# EAGLE design Device_board_191219 (EAGLE 9.5.1)
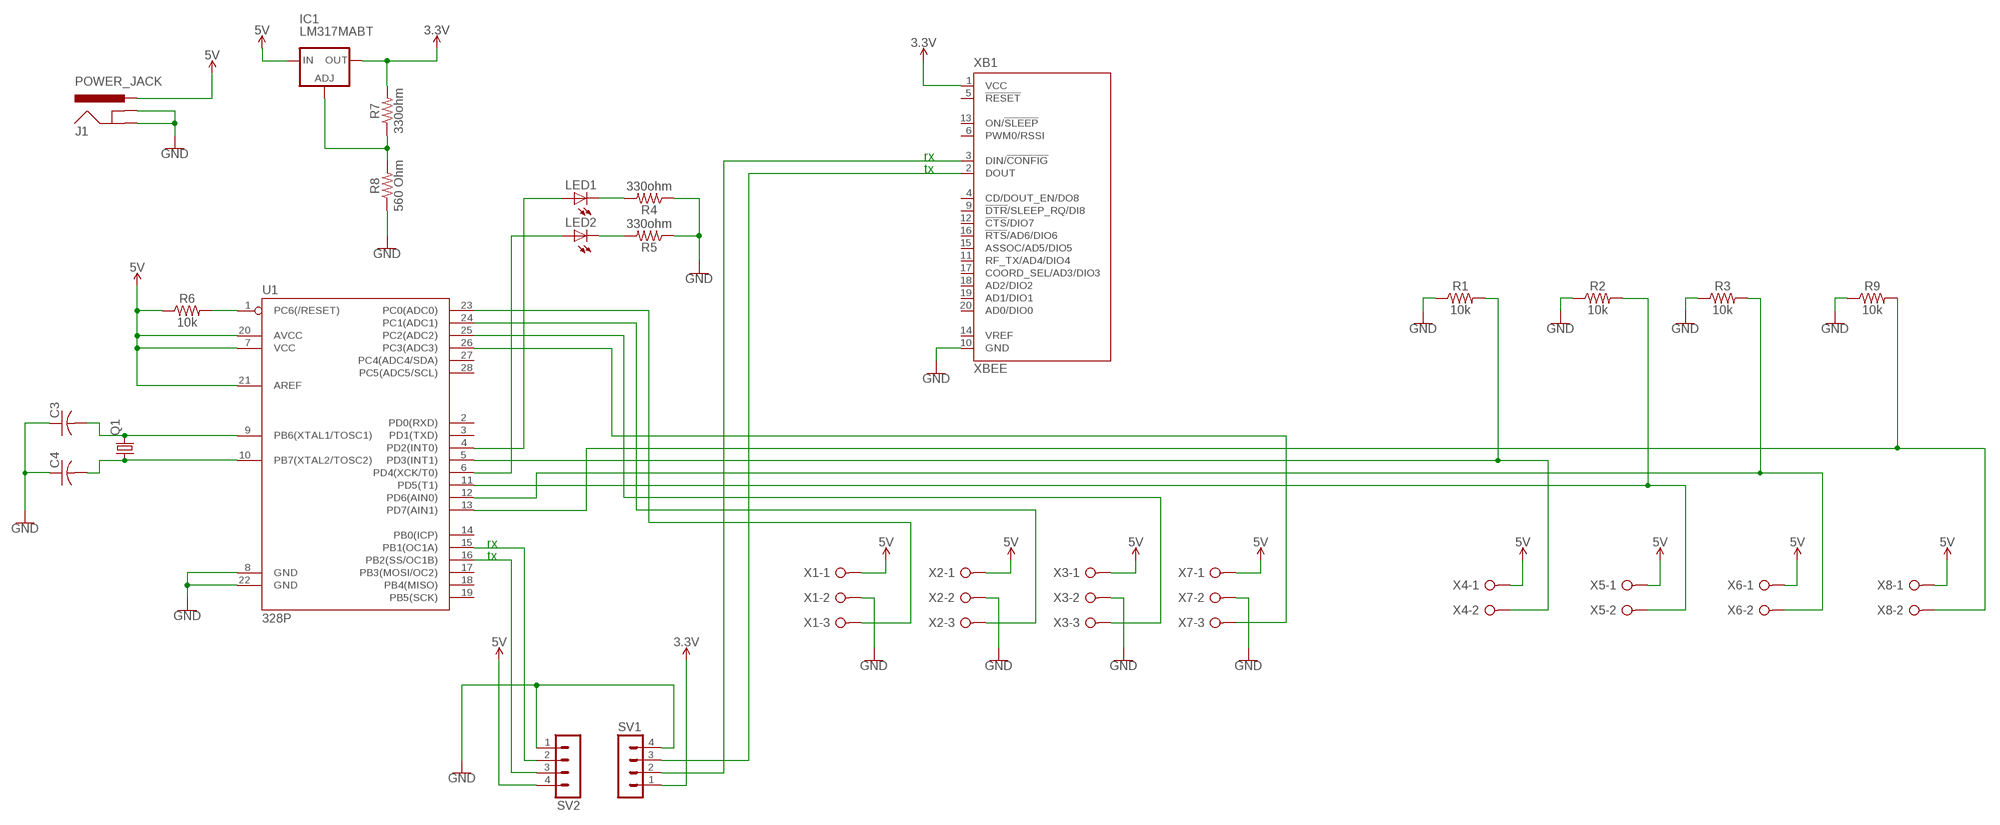
[diagram p0: schematic, sheet 1]

## Parts
C3  C-US050-025X075  [C050-025X075]
C4  C-US050-025X075  [C050-025X075]
IC1  LM317MABT  [TO220L1]
J1  POWER_JACK  [POWER_JACK_PTH]
LED1  LED3MM  [LED3MM]
LED2  LED3MM  [LED3MM]
Q1  CRYSTALHC49S  [HC49/S]
R1  10k  10KOHM-HORIZ-1/4W-5%  [AXIAL-0.3]
R2  10k  10KOHM-HORIZ-1/4W-5%  [AXIAL-0.3]
R3  10k  10KOHM-HORIZ-1/4W-5%  [AXIAL-0.3]
R4  330ohm  10KOHM-HORIZ-1/4W-5%  [AXIAL-0.3]
R5  330ohm  10KOHM-HORIZ-1/4W-5%  [AXIAL-0.3]
R6  10k  10KOHM-HORIZ-1/4W-5%  [AXIAL-0.3]
R7  330ohm  10KOHM-HORIZ-1/4W-5%  [AXIAL-0.3]
R8  560 Ohm  10KOHM-HORIZ-1/4W-5%  [AXIAL-0.3]
R9  10k  10KOHM-HORIZ-1/4W-5%  [AXIAL-0.3]
SV1  MA04-1  [MA04-1]
SV2  MA04-1  [MA04-1]
U1  328P  ATMEGA328P_PDIP  [DIP28]
X1  W237-3E  [W237-3E]
X2  W237-3E  [W237-3E]
X3  W237-3E  [W237-3E]
X4  W237-02P  [W237-132]
X5  W237-02P  [W237-132]
X6  W237-02P  [W237-132]
X7  W237-3E  [W237-3E]
X8  W237-02P  [W237-132]
XB1  XBEE  [XBEE]

## Nets
3.3V: IC1.2(OUT) R7.P$2 SV1.1 XB1.1(VCC)
5V: IC1.3(IN) J1.PWR R6.P$1 SV2.4 U1.7(VCC) U1.20(AVCC) U1.21(AREF) X1.1 X2.1 X3.1 X4.1 X5.1 X6.1 X7.1 X8.1
GND: C3.1 C4.1 J1.GND J1.GNDBREAK R1.P$1 R2.P$1 R3.P$1 R4.P$1 R5.P$1 R8.P$1 R9.P$1 SV1.4 SV2.1 U1.8(GND) U1.22(GND) X1.2 X2.2 X3.2 X7.2 XB1.10(GND)
N$1: SV1.2 XB1.3(DIN/!CONFIG)
N$2: SV1.3 XB1.2(DOUT)
N$3: U1.23(PC0(ADC0)) X1.3
N$4: U1.24(PC1(ADC1)) X2.3
N$5: U1.25(PC2(ADC2)) X3.3
N$6: R3.P$2 U1.12(PD6(AIN0)) X6.2
N$7: R1.P$2 U1.5(PD3(INT1)) X4.2
N$8: LED1.A U1.4(PD2(INT0))
N$9: LED2.A U1.6(PD4(XCK/T0))
N$10: U1.26(PC3(ADC3)) X7.3
N$11: LED2.K(C) R5.P$2
N$12: LED1.K(C) R4.P$2
N$13: C3.2 Q1.2 U1.9(PB6(XTAL1/TOSC1))
N$14: C4.2 Q1.1 U1.10(PB7(XTAL2/TOSC2))
N$15: R6.P$2 U1.1(PC6(/RESET))
N$16: IC1.1(ADJ) R7.P$1 R8.P$2
N$17: R2.P$2 U1.11(PD5(T1)) X5.2
N$18: R9.P$2 U1.13(PD7(AIN1)) X8.2
N$19: SV2.2 U1.15(PB1(OC1A))
N$20: SV2.3 U1.16(PB2(SS/OC1B))
Unconnected: U1.2(PD0(RXD)) U1.3(PD1(TXD)) U1.14(PB0(ICP)) U1.17(PB3(MOSI/OC2)) U1.18(PB4(MISO)) U1.19(PB5(SCK)) U1.27(PC4(ADC4/SDA)) U1.28(PC5(ADC5/SCL)) XB1.4(CD/DOUT_EN/DO8) XB1.5(!RESET) XB1.6(PWM0/RSSI) XB1.9(!DTR!/SLEEP_RQ/DI8) XB1.11(RF_TX/AD4/DIO4) XB1.12(!CTS!/DIO7) XB1.13(ON/!SLEEP) XB1.14(VREF) XB1.15(ASSOC/AD5/DIO5) XB1.16(!RTS!/AD6/DIO6) XB1.17(COORD_SEL/AD3/DIO3) XB1.18(AD2/DIO2) XB1.19(AD1/DIO1) XB1.20(AD0/DIO0)

## Notes on the sheet
- rx
- tx
- rx
- tx

## Library data of the parts
C3 C4 = adafruit:C-US: CAPACITOR, American symbol
IC1 = v-reg:LM317?*: 500 mA Adjustable Output Positive Voltage Regulator Source: http://www.onsemi.co.jp .. LM317M-D.PDF
J1 = SparkFun-Connectors:POWER_JACK: Power Jack Connector This is the standard 5.5mm barrel jack for power. The PTH is the most common, proven, reliable, footprint. The Slot footprint only works if the mill layer is transmitted to the PCB fab house so be warned. Here are the connectors we sell at SparkFun: DC Barrel Power Jack/Connector <https://www.sparkfun.com/products/119> (PRT-00119) DC Barrel Power Jack/Connector (SMD) <https://www.sparkfun.com/products/12748> (PRT-12748) DC Barrel Jack Adapter - Breadboard Compatible <https://www.sparkfun.com/products/10811> (PRT-10811) It is used on this SparkFun product (and many, many others): SparkFun RedBoard - Programmed with Arduino <https://www.sparkfun.com/products/12757> (DEV-12757) Also, if you need a mating power supply or connector, please check these out: Wall Adapter Power Supply - 9VDC 650mA <https://www.sparkfun.com/products/298> (TOL-00298) DC Barrel Jack Adapter - Male <https://www.sparkfun.com/products/10287> (PRT-10287); PROD_ID: CONN-08197
LED1 LED2 = adafruit:LED: LED OSRAM: - CHIPLED LG R971, LG N971, LY N971, LG Q971, LY Q971, LO R971, LY R971 LH N974, LH R974 LS Q976, LO Q976, LY Q976 LO Q996 - Hyper CHIPLED LW Q18S LB Q993, LB Q99A, LB R99A - SideLED LS A670, LO A670, LY A670, LG A670, LP A670 LB A673, LV A673, LT A673, LW A673 LH A674 LY A675 LS A676, LA A676, LO A676, LY A676, LW A676 LS A679, LY A679, LG A679 - Hyper Micro SIDELED® LS Y876, LA Y876, LO Y876, LY Y876 LT Y87S - SmartLED LW L88C, LW L88S LB L89C, LB L89S, LG L890 LS L89K, LO L89K, LY L89K LS L896, LA L896, LO L896, LY L896 - TOPLED LS T670, LO T670, LY T670, LG T670, LP T670 LSG T670, LSP T670, LSY T670, LOP T670, LYG T670 LG T671, LOG T671, LSG T671 LB T673, LV T673, LT T673, LW T673 LH T674 LS T676, LA T676, LO T676, LY T676, LB T676, LH T676, LSB T676, LW T676 LB T67C, LV T67C, LT T67C, LS T67K, LO T67K, LY T67K, LW E67C LS E67B, LA E67B, LO E67B, LY E67B, LB E67C, LV E67C, LT E67C LW T67C LS T679, LY T679, LG T679 LS T770, LO T770, LY T770, LG T770, LP T770 LB T773, LV T773, LT T773, LW T773 LH T774 LS E675, LA E675, LY E675, LS T675 LS T776, LA T776, LO T776, LY T776, LB T776 LHGB T686 LT T68C, LB T68C - Hyper Mini TOPLED® LB M676 - Mini TOPLED Santana® LG M470 LS M47K, LO M47K, LY M47K Source: http://www.osram.convergy.de/
Q1 = adafruit:CRYSTAL: CRYSTAL; OC_FARNELL: 1667008; OC_NEWARK: unknown
R1-R3 R6 R9 = SparkFun-Resistors:10KOHM: 10kΩ resistor A resistor is a passive two-terminal electrical component that implements electrical resistance as a circuit element. Resistors act to reduce current flow, and, at the same time, act to lower voltage levels within circuits. - Wikipedia; PROD_ID: RES-09435
R4 R5 R7 R8 = SparkFun-Resistors:10KOHM: 10kΩ resistor A resistor is a passive two-terminal electrical component that implements electrical resistance as a circuit element. Resistors act to reduce current flow, and, at the same time, act to lower voltage levels within circuits. - Wikipedia; PROD_ID: RES-09435; VALUE: 10k
SV1 SV2 = con-lstb:MA04-1: PIN HEADER; OC_FARNELL: unknown; OC_NEWARK: unknown
U1 = SparkFun-IC-Microcontroller:ATMEGA328P_PDIP: Atmel 328P Through hole ATMEGA328P uC used in the Arduino 32kb flash, 1k EEPROM, 2k SRAM Datasheet <http://www.sparkfun.com/datasheets/Components/SMD/ATMega328.pdf> SparkFun Products Storefront component: AVR 28 Pin 20MHz 32K 6A/D - ATMega328P <https://www.sparkfun.com/products/9061> (COM-09061) SparkFun Simon Says - Through-Hole Soldering Kit <https://www.sparkfun.com/products/10547> (KIT-10547) SparkFun Learn to Solder - Simon Says <https://www.sparkfun.com/products/13708> (KIT-13708) SparkFun BigTime Watch Kit <https://www.sparkfun.com/products/11734> (KIT-11734) SparkFun ClockIt <https://www.sparkfun.com/products/10930> (KIT-10930) SparkFun Serial Enabled LCD Kit <https://www.sparkfun.com/products/10097> (LCD-10097) SparkFun Simon Tilts - Through Hole Soldering Kit <https://www.sparkfun.com/products/12634> (KIT-12634) SparkFun Frequency Counter Kit <https://www.sparkfun.com/products/10140> (KIT-10140) FabFM Radio Kit <https://www.sparkfun.com/products/11043> (KIT-11043) SparkFun Binary Blaster Kit <https://www.sparkfun.com/products/12037> (KIT-12037) SparkFun Metro-Gnome <https://www.sparkfun.com/products/9236> (KIT-09236) ATmega328 with Arduino Optiboot (Uno) <https://www.sparkfun.com/products/10524> (DEV-10524); PROD_ID: IC-09136
X1-X3 X7 = con-wago-508:W237-3E: WAGO SREW CLAMP; OC_FARNELL: unknown; OC_NEWARK: unknown
X4-X6 X8 = con-wago-508:W237-02P: WAGO SREW CLAMP; OC_FARNELL: unknown; OC_NEWARK: unknown
XB1 = maxstream:XBEE: XBee (TM) /XBee-PRO(TM) OEM RF Modules Source: MaxStream, Inc. xbee_productmanual.pdf; MPN: XBP24-Z7UIT-004; OC_FARNELL: 1751799; OC_NEWARK: 34R5507

## Board
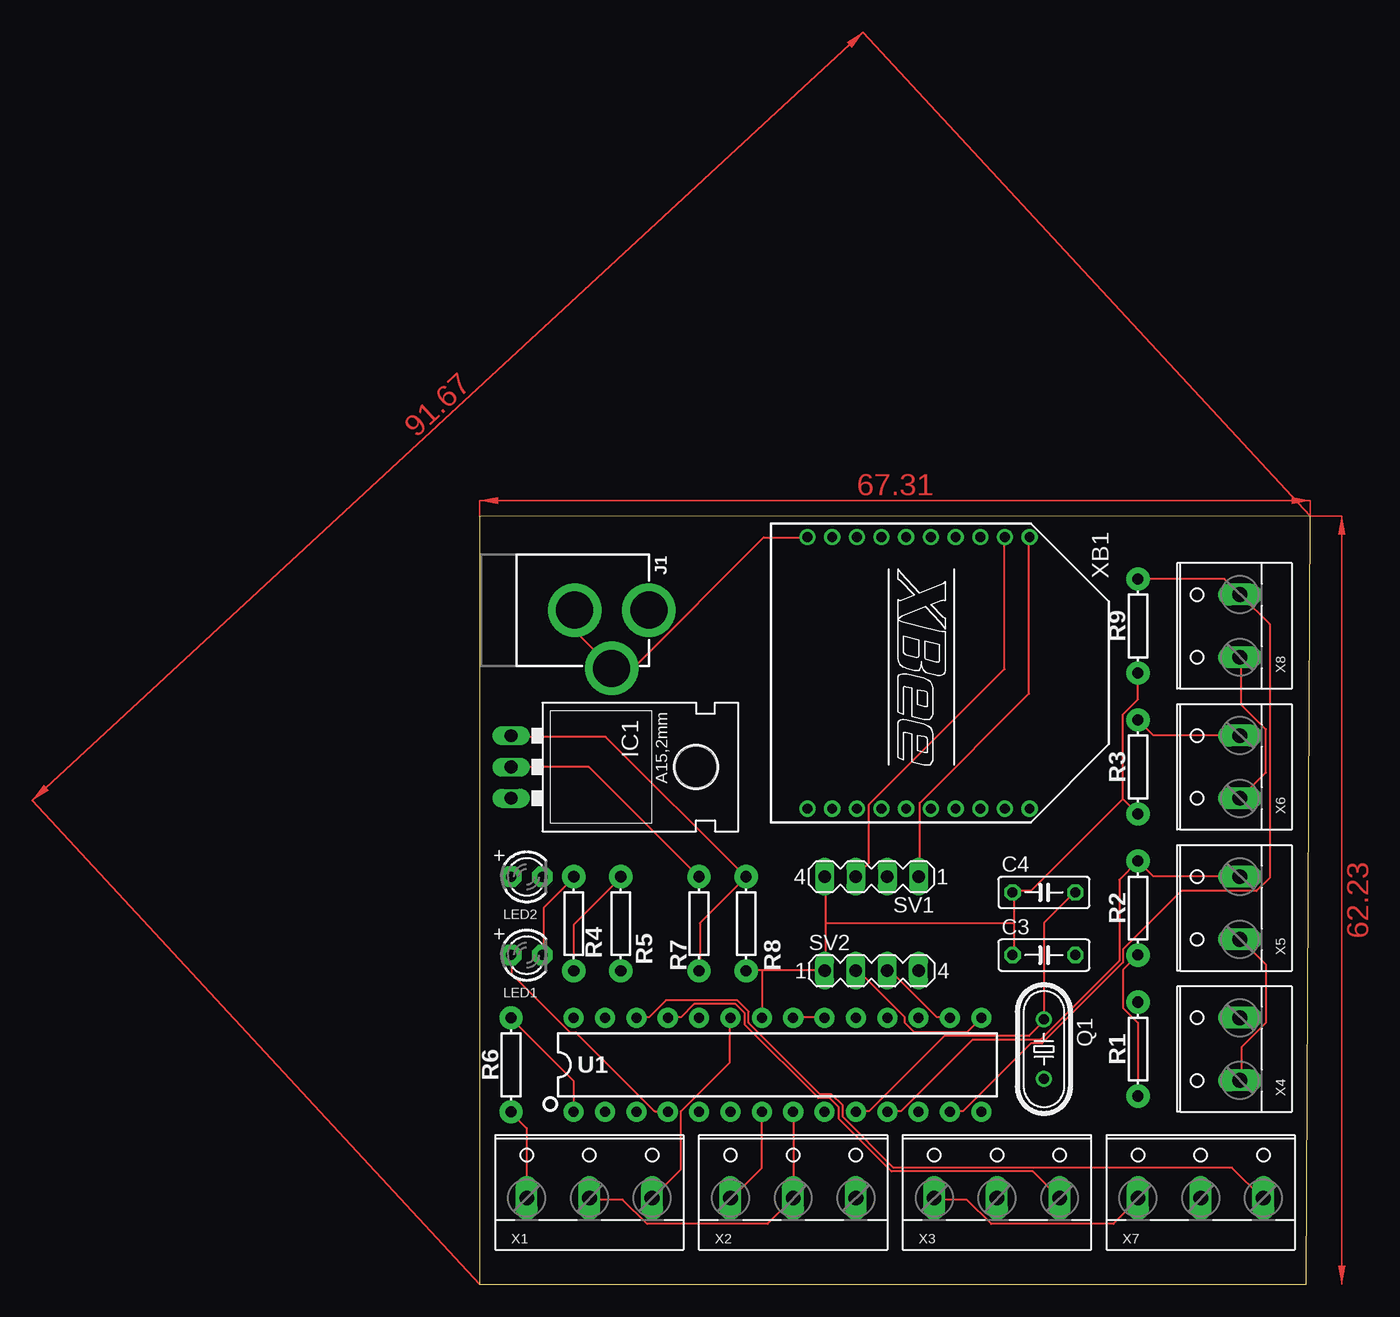
[diagram p1: board, top side]
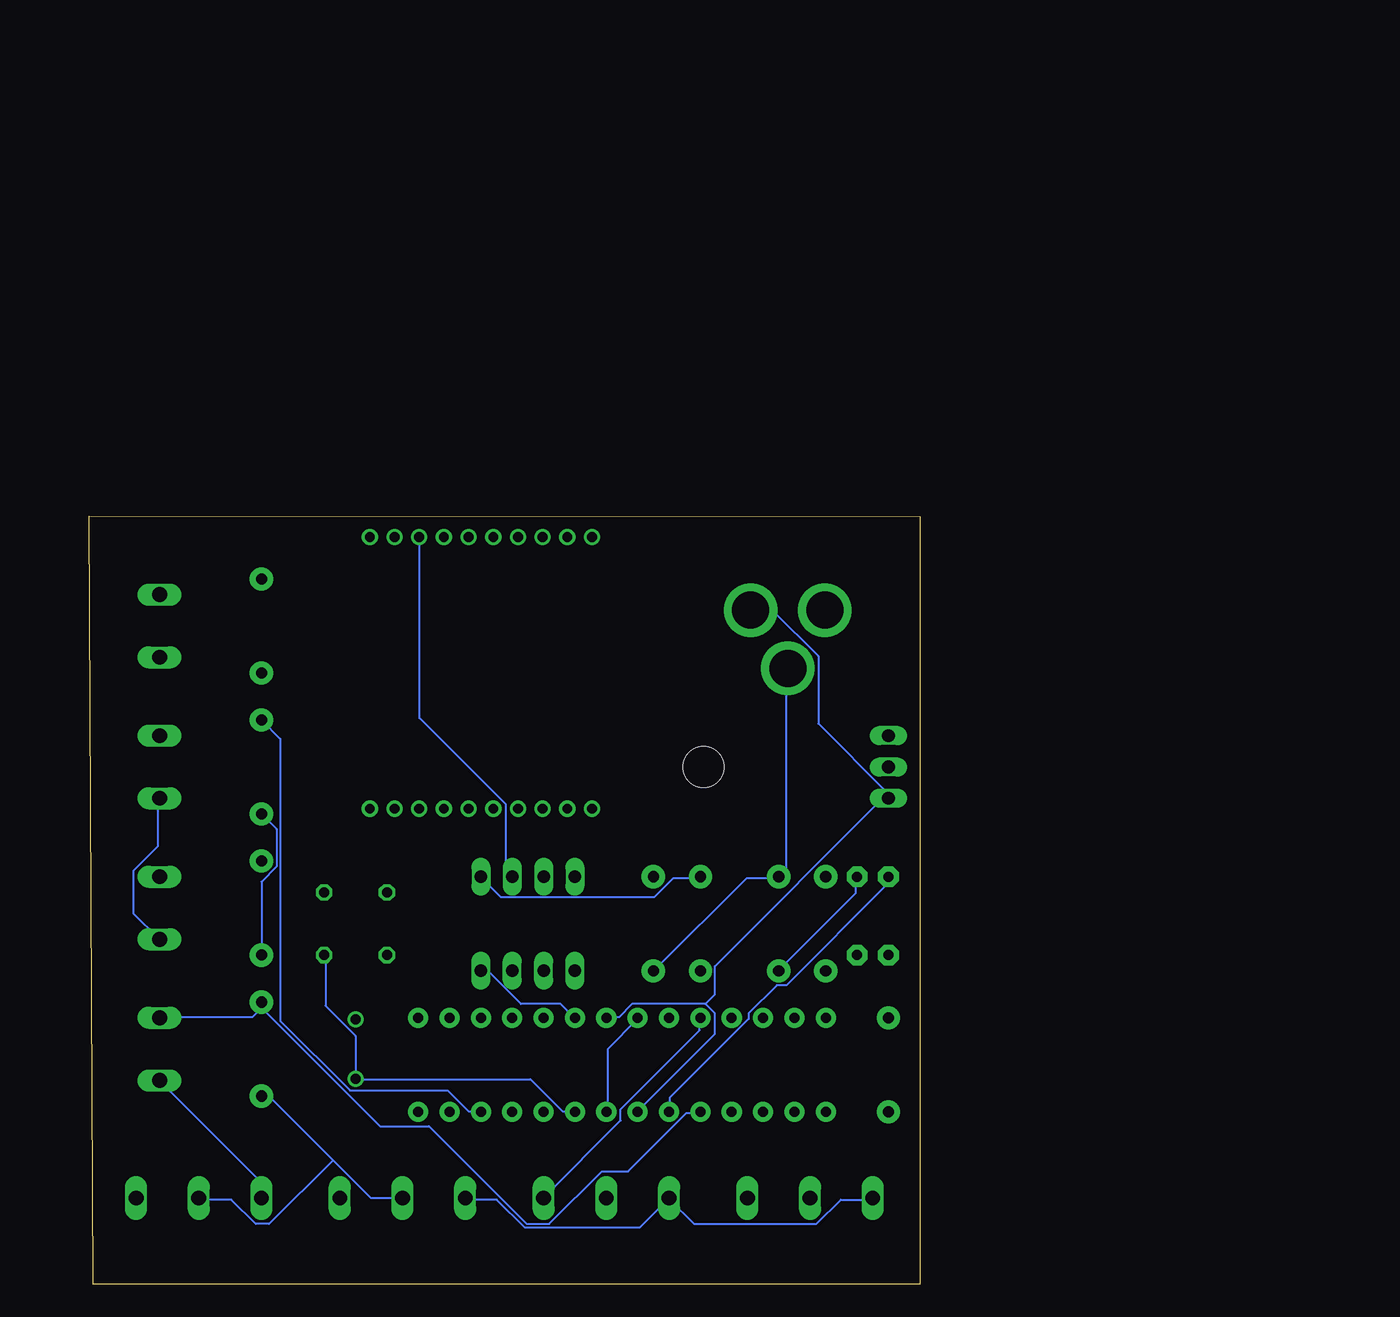
[diagram p2: board, bottom side, seen from below]

Size 67.31 x 62.23 mm. Coordinates in mm from the lower left corner, seen from the top.
Outline: 0,0 66.98,0 67.31,62.23 0,62.22 0,0
Copper layers (1*16): Top 0.035mm / dielectric 1.5mm / Bottom 0.035mm
Design rules "default": minimum track width 6mil, minimum drill 0.35mm, track to track 6mil, track to pad 6mil, pad to pad 6mil, via to via 6mil, smd to smd 6mil, copper to edge 40mil, drill to drill 6mil, minimum pad ring 10mil, minimum via ring 8mil, stop-mask expansion 4mil, vias tented up to drill 0mil, thermal gap 10mil

### Footprints (pad centres in the part's own frame; a part is rotated, then mirrored left to right if it is on the bottom)
C050-025X075 = drill 0.813 octagon: 1 -2.54,0; 2 2.54,0
TO220L1 = drill 1.016 long: 1 -2.54,-3.81; 2 0,-3.81; 3 2.54,-3.81 | hole 3.302: 0,11.176
POWER_JACK_PTH = drill 2.997 pad 4.318: GND 0,7.7; GNDBREAK 4.7,10.7; PWR 0,13.7
LED3MM = drill 0.813 pad 1.676 octagon: A -1.27,0; K 1.27,0
HC49/S = drill 0.813: 1 -2.413,0; 2 2.413,0
AXIAL-0.3 = drill 0.9 pad 1.88: P$1 -3.81,0; P$2 3.81,0
MA04-1 = drill 1.016 long: 1 -3.81,0; 2 -1.27,0; 3 1.27,0; 4 3.81,0
DIP28 = drill 0.813 pad 1.626: 1 -16.51,-3.81; 2 -13.97,-3.81; 3 -11.43,-3.81; 4 -8.89,-3.81; 5 -6.35,-3.81; 6 -3.81,-3.81; 7 -1.27,-3.81; 8 1.27,-3.81; 9 3.81,-3.81; 10 6.35,-3.81; 11 8.89,-3.81; 12 11.43,-3.81; 13 13.97,-3.81; 14 16.51,-3.81; 15 16.51,3.81; 16 13.97,3.81; 17 11.43,3.81; 18 8.89,3.81; 19 6.35,3.81; 20 3.81,3.81; 21 1.27,3.81; 22 -1.27,3.81; 23 -3.81,3.81; 24 -6.35,3.81; 25 -8.89,3.81; 26 -11.43,3.81; 27 -13.97,3.81; 28 -16.51,3.81
W237-3E = drill 1.194 long: 1 -5.08,-0.635; 2 0,-0.635; 3 5.08,-0.635
W237-132 = drill 1.194 long: 1 -2.54,-0.635; 2 2.54,-0.635
XBEE = drill 0.8 pad 1.27: 1 -11,9; 2 -11,7; 3 -11,5; 4 -11,3; 5 -11,1; 6 -11,-1; 7 -11,-3; 8 -11,-5; 9 -11,-7; 10 -11,-9; 11 11,-9; 12 11,-7; 13 11,-5; 14 11,-3; 15 11,-1; 16 11,1; 17 11,3; 18 11,5; 19 11,7; 20 11,9

### Placement (x,y rotation side)
C3  45.72,26.67 0 top
C4  45.72,31.75 0 top
IC1  6.35,41.91 270 top
J1  0,54.61 270 top
LED1  3.81,26.67 0 top
LED2  3.81,33.02 0 top
Q1  45.72,19.05 270 top
R1  53.34,19.05 90 top
R2  53.34,30.48 90 top
R3  53.34,41.91 90 top
R4  7.62,29.21 90 top
R5  11.43,29.21 270 top
R6  2.54,17.78 90 top
R7  17.78,29.21 90 top
R8  21.59,29.21 90 top
R9  53.34,53.34 90 top
SV1  31.75,33.02 180 top
SV2  31.75,25.4 0 top
U1  24.13,17.78 0 top
X1  8.89,7.62 0 top
X2  25.4,7.62 0 top
X3  41.91,7.62 0 top
X4  60.96,19.05 90 top
X5  60.96,30.48 90 top
X6  60.96,41.91 90 top
X7  58.42,7.62 0 top
X8  60.96,53.34 90 top
XB1  35.56,49.53 270 top

### Tracks (layer width: path | path; a pad name or v marks a point on that pad's centre or on a via)
3.3V
  Top 0.152: IC1.2 8.84,41.91 17.68,33.07 R7.P$2 | XB1.1 44.5,60.5 44.5,47.85 35.66,39.01 35.66,33.07 SV1.1
  Bottom 0.152: R7.P$2 17.83,32.92 19.96,32.92 21.49,31.39 33.98,31.39 35.51,32.92 SV1.1
5V
  Top 0.152: X3.1 36.88,6.86 39.47,6.86 41.45,4.88 51.36,4.88 53.34,6.86 X7.1 | X4.1 61.72,16.61 61.72,19.2 63.7,21.18 63.7,25.91 61.72,27.89 X5.1 | X8.1 61.72,50.75 61.72,46.94 63.7,44.96 63.7,41.45 61.72,39.47 X6.1 | U1.21 25.45,21.64 27.89,21.64 U1.20 | X1.1 3.81,12.65 2.59,13.87 R6.P$1 | U1.7 22.86,9.45 20.42,7.01 X2.1
  Bottom 0.152: 27.94,21.64 U1.20 28.04,21.64 29.11,22.71 32.31,22.71 34.9,25.3 35.51,25.3 SV2.4 | X6.1 61.72,39.32 61.72,35.51 63.7,33.53 63.7,30.02 61.72,28.04 X5.1 | X7.1 53.34,8.23 61.57,16.46 X4.1 | J1.PWR 13.56,54.56 11.89,54.56 8.23,50.9 8.23,45.41 2.59,39.78 2.59,39.47 IC1.3 2.59,39.32 3.05,39.32 16.61,25.76 16.61,23.47 17.37,22.71 | X1.1 3.81,6.86 6.4,6.86 8.38,4.88 18.29,4.88 20.27,6.86 X2.1 20.42,6.86 22.71,4.57 32,4.57 34.29,6.86 36.73,6.86 X3.1 | 17.37,22.71 23.32,22.71 24.38,21.64 25.3,21.64 U1.21 | 17.37,22.71 16.61,21.95 16.61,20.27 22.86,14.02 U1.7
GND
  Top 0.152: 43.28,29.26 43.28,31.7 C4.1 43.28,31.85 44.65,31.85 52.12,39.32 | 43.28,29.26 43.28,26.67 C3.1 | R9.P$1 53.34,47.4 52.12,46.18 52.12,39.32 | R3.P$1 52.12,39.32 | R1.P$1 53.34,21.18 52.12,22.4 52.12,25.45 R2.P$1 | XB1.10 26.52,60.5 23.01,60.5 12.5,49.99 10.82,49.99 J1.GNDBREAK 10.67,49.99 7.77,52.88 7.77,54.56 J1.GND | U1.8 25.45,13.87 25.45,7.01 X2.2 25.3,6.86 23.32,4.88 13.56,4.88 11.58,6.86 8.99,6.86 X1.2 | R4.P$1 7.62,29.11 11.43,32.92 R5.P$1 | 22.86,25.45 21.64,25.45 R8.P$1 | 22.86,25.45 27.89,25.45 SV2.1 28.04,25.45 28.04,29.26 | 28.04,29.26 28.04,32.92 SV1.4 | 22.86,25.45 U1.22 | 28.04,29.26 43.28,29.26
  Bottom 0.152: 41.96,7.01 X3.2 41.91,7.01 44.5,7.01 47.55,10.06 | 58.42,6.86 X7.2 58.37,6.86 55.78,6.86 53.8,4.88 52.73,4.88 47.55,10.06 | 27.99,25.45 SV2.1 | 47.55,10.06 52.73,15.24 R1.P$1 | R2.P$1 53.34,32.61 52.12,33.83 52.12,36.88 R3.P$1 | R8.P$1 21.49,25.45 14.02,32.92 11.43,32.92 R5.P$1 11.43,33.07 10.82,33.68 10.82,49.84 J1.GNDBREAK | U1.8 25.3,14.02 25.3,19.05 22.86,21.49 U1.22
N$1
  Bottom 0.152: SV1.2 33.53,33.53 33.53,38.86 40.54,45.87 40.54,60.5 XB1.3
N$2
  Top 0.152: XB1.2 42.52,60.5 42.52,49.84 31.55,38.86 31.55,34.14 30.48,33.07 SV1.3
N$3
  Top 0.152: U1.23 20.27,21.49 20.27,17.98 16.31,14.02 16.31,9.3 14.02,7.01 X1.3
N$4
  Bottom 0.152: U1.24 17.83,21.49 17.83,20.57 24.23,14.17 24.23,13.26 30.48,7.01 X2.3
N$5
  Top 0.152: U1.25 15.24,21.64 16.31,21.64 17.37,22.71 20.73,22.71 21.49,21.95 21.49,21.03 27.43,15.09 28.35,15.09 29.11,14.33 29.11,13.41 33.38,9.14 44.81,9.14 46.94,7.01 X3.3
N$6
  Top 0.152: R3.P$2 54.56,44.5 61.57,44.5 X6.2
  Bottom 0.152: 35.56,14.02 U1.12 35.66,14.02 36.58,14.02 38.25,15.7 46.18,15.7 51.82,21.34 51.82,44.2 R3.P$2
N$7
  Bottom 0.152: 53.34,22.4 43.74,12.8 39.78,12.8 31.85,4.88 30.02,4.88 25.76,9.14 23.62,9.14 18.9,13.87 17.83,13.87 U1.5 | 53.34,22.4 54.1,21.64 61.57,21.64 X4.2 | 53.34,22.4 R1.P$2
N$8
  Top 0.152: U1.4 15.24,14.02 14.17,14.02 7.77,20.42 7.32,20.42 2.59,25.15 2.59,26.67 LED1.A
N$9
  Bottom 0.152: U1.6 20.27,14.02 20.27,15.09 13.87,21.49 13.87,21.95 11.58,24.23 10.82,24.23 2.59,32.46 2.59,32.92 LED2.A
N$10
  Top 0.152: U1.26 12.8,21.64 13.72,21.64 15.09,23.01 20.88,23.01 21.79,22.1 21.79,21.18 27.58,15.39 28.5,15.39 29.41,14.48 29.41,13.56 33.53,9.45 60.96,9.45 63.4,7.01 X7.3
N$11
  Bottom 0.152: LED2.K 5.18,32.92 5.18,31.7 11.43,25.45 R5.P$2
N$12
  Top 0.152: LED1.K 5.18,26.67 5.18,30.48 7.62,32.92 R4.P$2
N$13
  Bottom 0.152: 27.94,14.02 U1.9 28.04,14.02 28.96,14.02 31.55,16.61 45.72,16.61 Q1.2 45.72,20.12 48.16,22.55 48.16,26.67 C3.2
N$14
  Top 0.152: C4.2 48.16,31.7 45.72,29.26 Q1.1 45.72,21.34 44.5,20.12 37.64,20.12 31.55,14.02 30.48,14.02 U1.10
N$15
  Top 0.152: U1.1 7.62,16.46 2.59,21.49 R6.P$2
N$16
  Top 0.152: IC1.1 2.59,44.35 10.21,44.35 21.49,33.07 R8.P$2 17.83,29.26 17.83,25.45 R7.P$1
N$17
  Top 0.152: U1.11 33.07,14.02 34.14,14.02 39.93,19.81 45.41,19.81 51.82,26.21 51.82,32.77 R2.P$2 54.56,33.07 61.57,33.07 X5.2
N$18
  Top 0.152: U1.13 38.1,14.02 39.17,14.02 44.65,19.51 45.57,19.51 52.12,26.06 52.12,27.13 56.84,31.85 62.94,31.85 64.01,32.92 64.01,53.49 61.72,55.78 X8.2 61.57,55.93 60.35,57.15 R9.P$2
N$19
  Top 0.152: U1.15 39.47,20.42 35.2,20.42 34.44,21.18 34.44,21.64 30.79,25.3 30.48,25.3 SV2.2
N$20
  Top 0.152: SV2.3 33.07,25.3 33.38,25.3 37.03,21.64 38.1,21.64 U1.16
(copper drawn outside any net)
  shapes: Top area x3